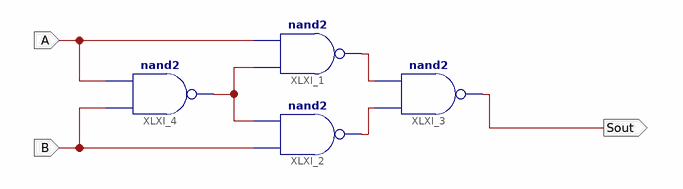
[diagram p0: schematic sheet 1]
// Xilinx ISE schematic XOR.sch (spartan3e) as structural Verilog: 4 symbols, 3 ports
module XOR (
  input  B,
  input  A,
  output Sout
);

  wire XLXN_10, XLXN_16, XLXN_18;

  nand XLXI_3 (Sout, XLXN_18, XLXN_16);
  nand XLXI_4 (XLXN_10, B, A);
  nand XLXI_1 (XLXN_16, XLXN_10, A);
  nand XLXI_2 (XLXN_18, B, XLXN_10);
endmodule
